# Altium schematic sheet Power_Board_Components.SchDoc: Powerboard Components
size A4; Author: Ellen Wang; Organization: Waterloop; Address1: 200 University Ave W; Address2: Engineering 5, 1104; Address3: Waterloo, ON; Address4: N2LO 3G1; Revision: 1.1; SheetNumber: 2; SheetTotal: 2
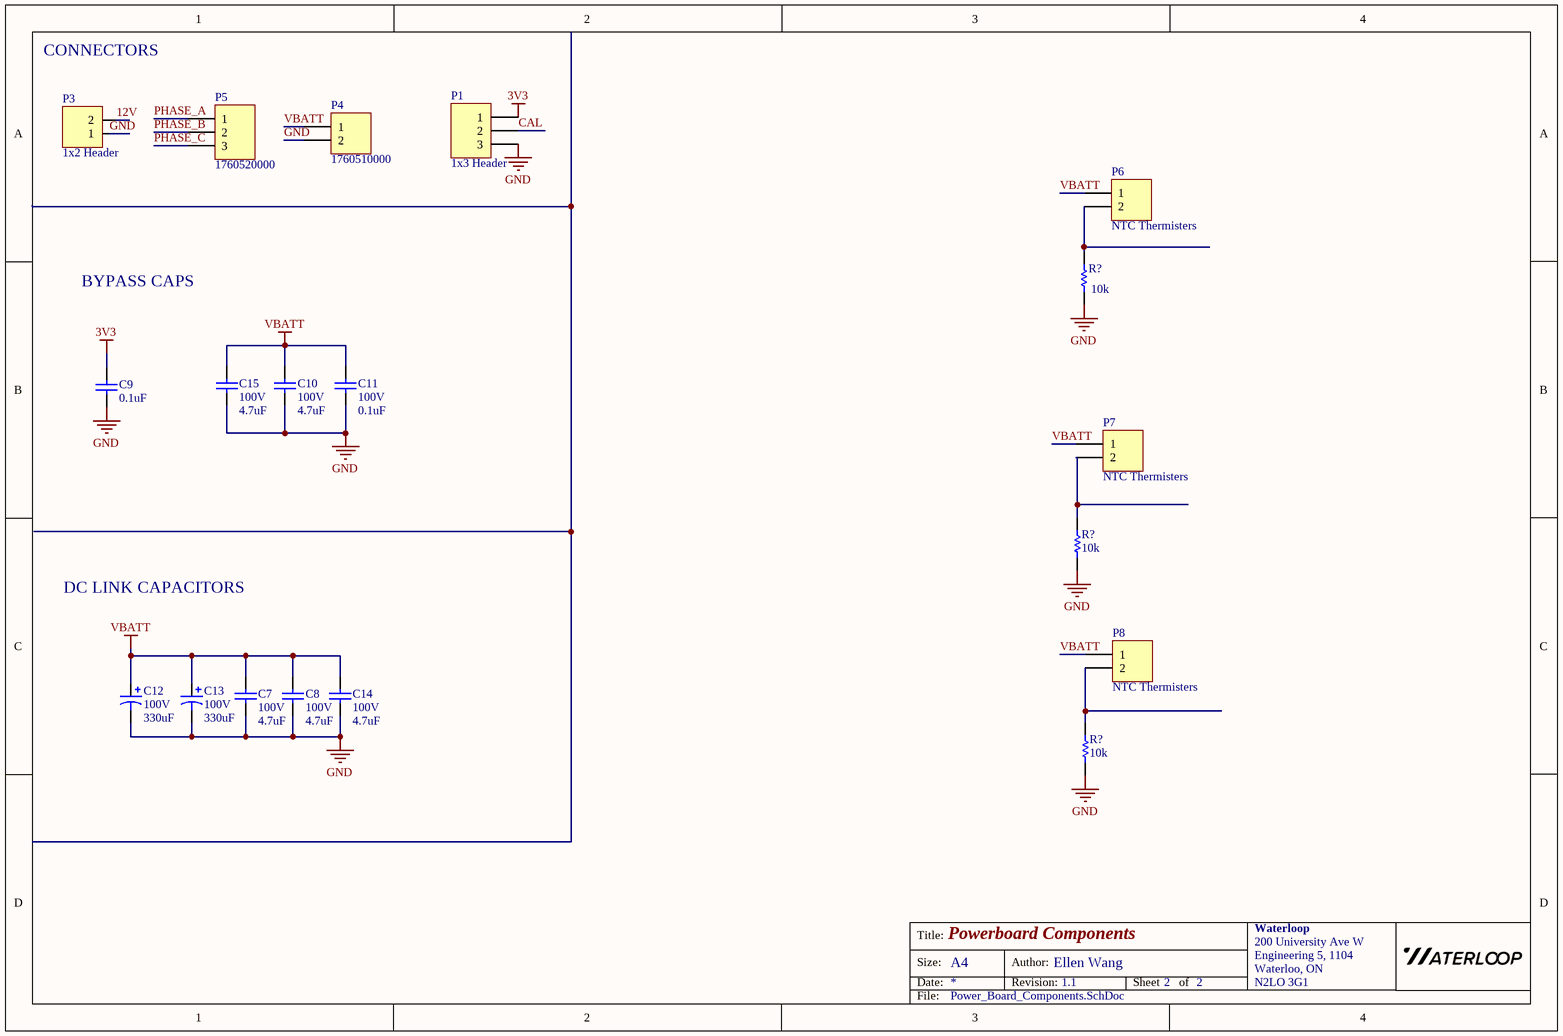
[diagram p0: Power_Board_Components.SchDoc]

## Parts
(Parts that share a designator on the sheet are numbered #1, #2 ... from top to bottom, then left to right.)
C7  value 4.7uF  Rating: 100V  [1210 - Capacitor]  (hidden comment: Capacitor - Nonpolarized)
C8  value 4.7uF  Rating: 100V  [1210 - Capacitor]  (hidden comment: Capacitor - Nonpolarized)
C9  value 0.1uF  [0805 - Capacitor]  (hidden comment: Capacitor - Nonpolarized)
C10  value 4.7uF  Rating: 100V  [1210 - Capacitor]  (hidden comment: Capacitor - Nonpolarized)
C11  value 0.1uF  Rating: 100V  [0805 - Capacitor]  (hidden comment: Capacitor - Nonpolarized)
C12  value 330uF  Rating: 100V  [OCVZ0606 - CAPACITOR]  (hidden comment: Capacitor - Polarized)
C13  value 330uF  Rating: 100V  [OCVZ0606 - CAPACITOR]  (hidden comment: Capacitor - Polarized)
C14  value 4.7uF  Rating: 100V  [1210 - Capacitor]  (hidden comment: Capacitor - Nonpolarized)
C15  value 4.7uF  Rating: 100V  [1210 - Capacitor]  (hidden comment: Capacitor - Nonpolarized)
P1  1x3 Header  [HDR1X3]
P3  1x2 Header  [HDR1X2]
P4  1760510000  [1760510000]
P5  1760520000  [1760520000]
P6  NTC Thermisters  [HDR1X2]
P7  NTC Thermisters  [HDR1X2]
P8  NTC Thermisters  [HDR1X2]
R?#1  value 10k  [0603 - Resistor]  (hidden comment: Resistor)
R?#2  value 10k  [0603 - Resistor]  (hidden comment: Resistor)
R?#3  value 10k  [0603 - Resistor]  (hidden comment: Resistor)

## Nets
3V3: C9.1 P1.1
GND: C7.2 C8.2 C9.2 C10.2 C11.2 C12.2 C13.2 C14.2 C15.2 P1.3 P3.1 P4.2 R?#1.1 R?#2.1 R?#3.1
VBATT: C7.1 C8.2 C10.2 C11.2 C12.1 C13.1 C14.2 C15.2 P4.1 P6.1 P7.1 P8.1
12V: P3.2
CAL: P1.2
PHASE_A: P5.1
PHASE_B: P5.2
PHASE_C: P5.3
NetP6_2: P6.2 R?#1.2
NetP7_2: P7.2 R?#2.2
NetP8_2: P8.2 R?#3.2

## Notes on the sheet
- CONNECTORS
- BYPASS CAPS
- DC LINK CAPACITORS
- Title:
- Size:
- Date:
- A4
- Author:
- Revision:
- Sheet
- of
- File:

## Library data of the parts
C7 C8 C10 C14 C15 = Capacitor - Nonpolarized: Nonpolarized Capacitor; Manufacturer: Holy Stone Enterprise Co., Ltd.; Manufacturer Part Number: C1210X475K101T; Supplier Part Number: 2873-C1210X475K101TCT-ND; Supplier: Digikey
C9 = Capacitor - Nonpolarized: Nonpolarized Capacitor; Manufacturer: Samsung Electro-Mechanics; Manufacturer Part Number: CL21B104KCFWPNE; Rating: 100V; Supplier Part Number: 1276-6733-1-ND; Supplier: Digikey
C11 = Capacitor - Nonpolarized: Nonpolarized Capacitor; Manufacturer: Samsung Electro-Mechanics; Manufacturer Part Number: CL21B104KCFWPNE; Supplier Part Number: 1276-6733-1-ND; Supplier: Digikey
C12 C13 = Capacitor - Polarized: Polarized Capacitor; Manufacturer: Panasonic Electronic Components; Manufacturer Part Number: EEE-FK2A331AM; Supplier: Digikey; Supplier Part Number: PCE4867CT-ND
P1 = 1x3 Header: 1x3 Pin Header
P3 = 1x2 Header: 1x2 Pin Header
P4 = 1760510000: 1x2 Screw Terminal Block; Manufacturer Part Number: OSTTC022162; Manufacturer: On Shore Technology Inc.; Supplier Part Number: ED2609-ND; Supplier: Digikey; ComponentLink1Description: Datasheet; ComponentLink1URL: http://www.on-shore.com/wp-content/uploads/OSTTCXX2162.pdf
P5 = 1760520000: 1x3 Screw Terminal Block; Manufacturer Part Number: 282857-3; Manufacturer: TE Connectivity AMP Connectors; Supplier: Digikey; Supplier Part Number: A98360-ND; ComponentLink1Description: Datasheet; ComponentLink1URL: https://media.digikey.com/pdf/Data%20Sheets/Weidmuller%20PDFs/1760520000.pdf
P6-P8 = Header 2: Header, 2-Pin; LatestRevisionDate: 17-Jul-2002; LatestRevisionNote: Re-released for DXP Platform.; Publisher: Altium Limited
R?#1-R?#3 = Resistor: Rating: *; Manufacturer Part Number: *; Manufacturer: *; Supplier Part Number: *; Supplier: *